# EAGLE design gyro_board (EAGLE 8.1.1)
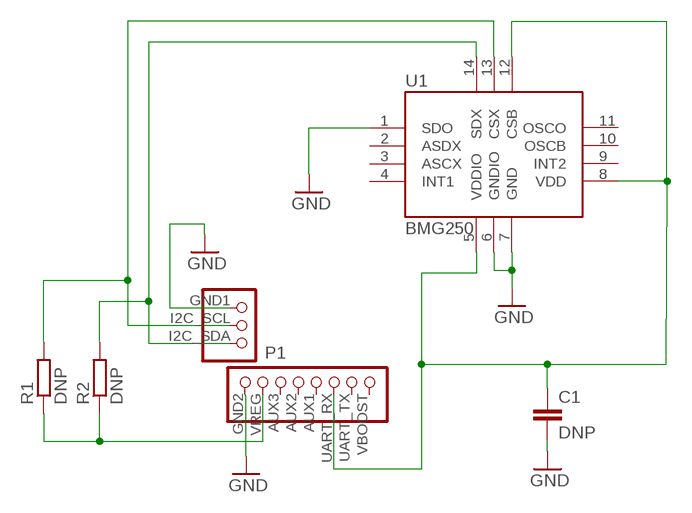
[diagram p0: schematic, sheet 1]

## Parts
C1  DNP  C-EUC0603  [C0603]
P1  WISP_HEADER  [PINHEAD_WISP3X8-1.27MM]
R1  DNP  R-EU_R0603  [R0603]
R2  DNP  R-EU_R0603  [R0603]
U1  BMG250  BGM250  [LGA14L]

## Nets
GND: C1.2 P1.GND1 P1.GND2 U1.1(SDO) U1.6(GNDIO) U1.7(GND)
SCL: P1.I2C_SCL R1.2 U1.13(CSX)
SDA: P1.I2C_SDA R2.2 U1.14(SDX)
VEN: C1.1 P1.UART_RX U1.5(VDDIO) U1.8(VDD) U1.12(CSB)
VREG: P1.VREG R1.1 R2.1
Unconnected: P1.AUX1 P1.AUX2 P1.AUX3 P1.UART_TX P1.VBOOST U1.2(ASDX) U1.3(ASCX) U1.4(INT1) U1.9(INT2) U1.10(OSCB) U1.11(OSCO)

## Library data of the parts
C1 = resistor:C-EU: CAPACITOR, European symbol
P1 = robot_pcb2:WISP_HEADER
R1 R2 = resistor:R-EU_: RESISTOR, European symbol
U1 = robot_pcb2:BGM250

## Board
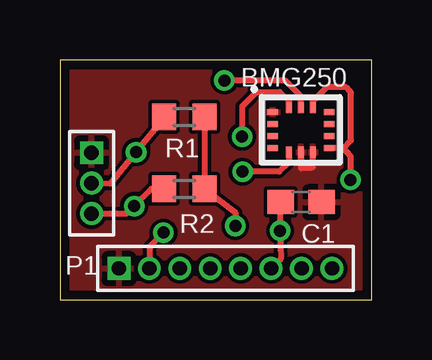
[diagram p1: board, top side]
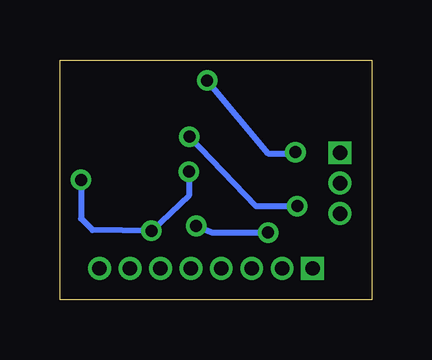
[diagram p2: board, bottom side, seen from below]

Size 13 x 10 mm. Coordinates in mm from the lower left corner, seen from the top.
Outline: 0,0 13,0 13,10 0,10 0,0
Copper layers (1*16): Top 0.0356mm / dielectric 1.5011mm / Bottom 0.0356mm
Design rules "oshpark-2layer *": minimum track width 6mil, minimum drill 13mil, track to track 6mil, track to pad 6mil, pad to pad 6mil, via to via 6mil, smd to smd 6mil, copper to edge 15mil, drill to drill 6mil, minimum pad ring 7mil, minimum via ring 7mil, stop-mask expansion 2.5mil, vias tented up to drill 20mil, thermal gap 10mil

### Footprints (pad centres in the part's own frame; a part is rotated, then mirrored left to right if it is on the bottom)
C0603 = smd 1.1 x 1: 1 -0.85,0; 2 0.85,0
PINHEAD_WISP3X8-1.27MM = drill 0.6: AUX1 2.54,0; AUX2 1.27,0; AUX3 0,0; I2C_SCL -3.683,3.556; I2C_SDA -3.683,2.286; UART_RX 3.81,0; UART_TX 5.08,0; VBOOST 6.35,0; VREG -1.27,0 | drill 0.6 square: GND1 -3.683,4.826; GND2 -2.54,0
R0603 = smd 1 x 1.1: 1 -0.85,0; 2 0.85,0
LGA14L = smd 0.45 x 0.25: 1 -1.175,0.75; 2 -1.175,0.25; 3 -1.175,-0.25; 4 -1.175,-0.75; 8 1.175,-0.75; 9 1.175,-0.25; 10 1.175,0.25; 11 1.175,0.75 | smd 0.25 x 0.45: 5 -0.5,-0.925; 6 0,-0.925; 7 0.5,-0.925; 12 0.5,0.925; 13 0,0.925; 14 -0.5,0.925

### Placement (x,y rotation side)
C1  10.06,4.07 0 top
P1  5,1.3 0 top
R1  5.19,7.62 180 top
R2  5.19,4.62 180 top
U1  10.05,7.08 0 top

### Tracks (layer width: path | path; a pad name or v marks a point on that pad's centre or on a via)
GND
  Top 0.254: U1.6 10.06,5.49 10.54,5.51 U1.7
  pour Top: 0,10 13,10 13,0 0,0
SCL  (via drill 0.5)
  Top 0.254: P1.I2C_SCL 2.1,4.84 2.11,4.84 v3.18,6.15 4.34,7.57 R1.2 | U1.13 10.05,8.49 9.4,9.14 v6.86,9.14
  Bottom 0.254: v6.86,9.14 4.32,6.1 3.23,6.1 v3.18,6.15
SDA  (via drill 0.5)
  Top 0.254: P1.I2C_SDA 2.8,3.6 v3.1,3.9 3.82,4.62 R2.2 | v7.6,6.8 7.6,8.06 8.2,8.66 9.17,8.66 9.55,8.27 U1.14
  Bottom 0.254: v7.6,6.8 4.82,3.9 v3.1,3.9
VEN  (via drill 0.5)
  Top 0.254: C1.1 v9.19,2.87 9.21,1.7 P1.UART_RX | 11.81,6.32 11.8,6.33 U1.8 | 11.81,6.32 12.14,6.65 12.14,8.63 11.94,8.86 11.14,8.86 10.55,8.27 U1.12 | 11.81,6.32 12.12,5.98 v12.12,5 | U1.5 9.55,5.74 9.14,5.33 v7.62,5.33
  Bottom 0.254: v12.12,5 12.12,3.38 11.64,2.9 v9.19,2.87 7.62,4.34 v7.62,5.33
VREG  (via drill 0.5)
  Top 0.254: 3.73,1.73 P1.VREG 3.73,2.21 v4.32,2.79 | R1.1 R2.1 7.32,3.63 v7.32,3.07
  Bottom 0.254: v7.32,3.07 6.63,2.79 v4.32,2.79